# Altium schematic sheet Stylophone.SchDoc
size A4; SheetNumber: 1; SheetTotal: 1
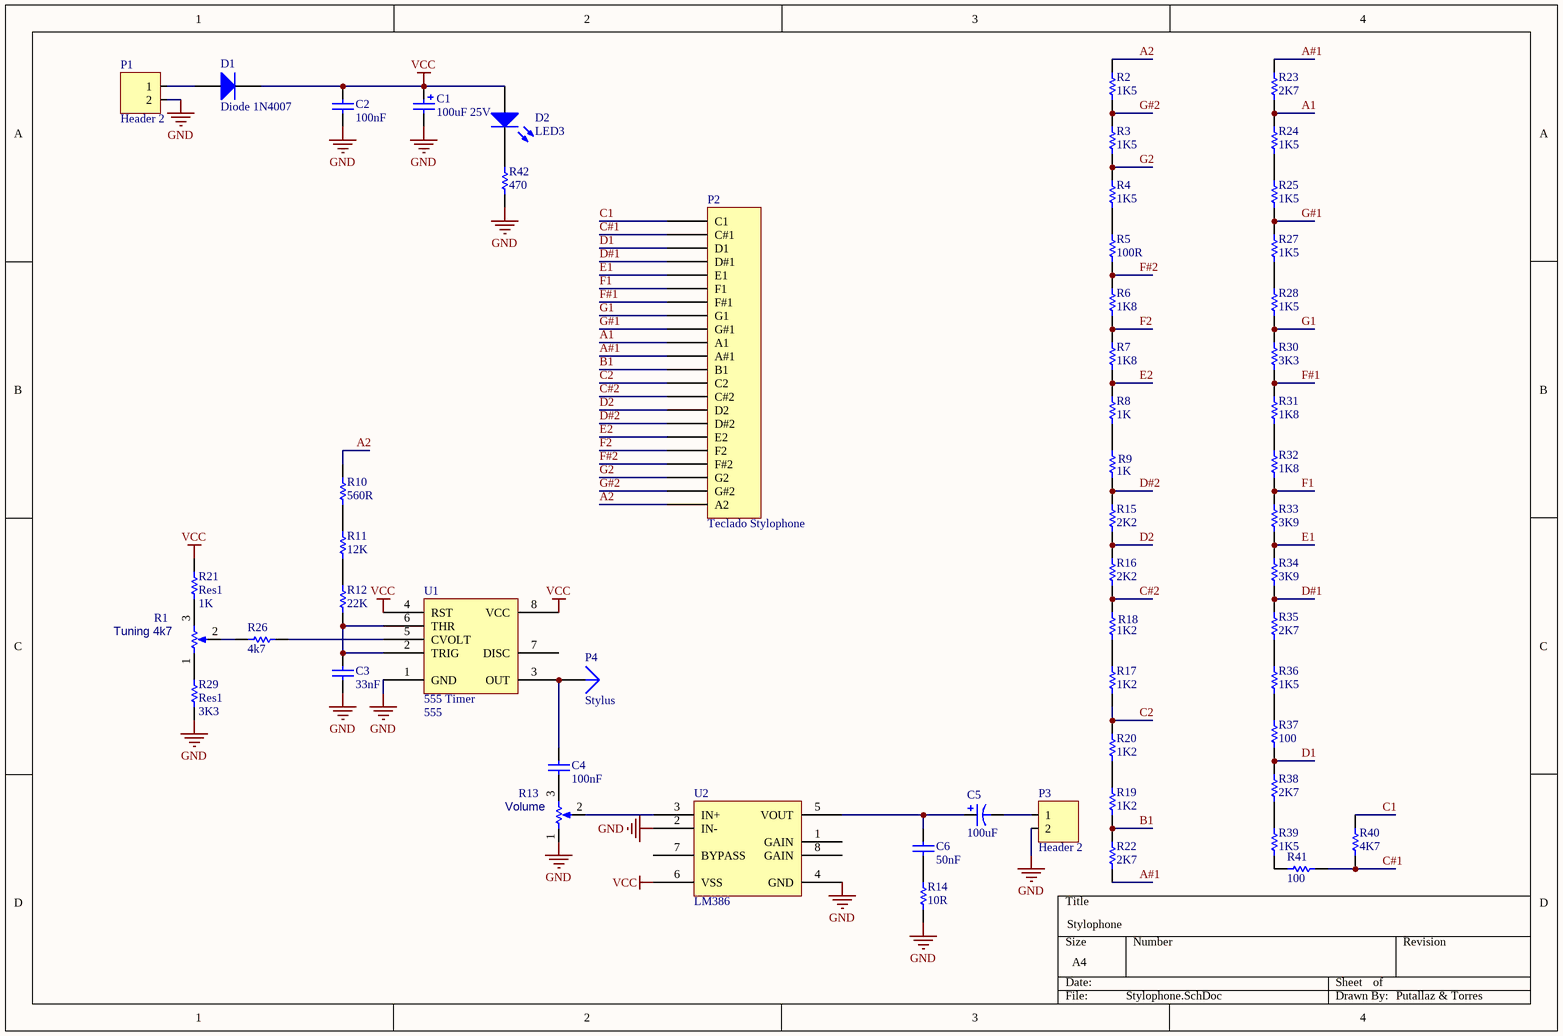
[diagram p0: Stylophone.SchDoc]

## Parts
C1  100uF 25V  [CAP SMD 100uF 25V]
C2  100nF  [0805 res-cap]
C3  33nF  [0805 res-cap]
C4  100nF  [0805 res-cap]
C5  100uF  [CAP SMD 100uF 25V]
C6  50nF  [0805 res-cap]
D1  Diode 1N4007  [DO214AC]
D2  LED3  [1206 LED]
P1  Header 2  [HDR1X2]
P2  Teclado Stylophone  [Teclado Stylophone]
P3  Header 2  [HDR1X2]
P4  Stylus  [PIN1]
R1  Tuning 4k7  [TRIMMING POTENTIOMETER]
R2  1K5  [0805 res]
R3  1K5  [0805 res]
R4  1K5  [0805 res]
R5  100R  [0805 res]
R6  1K8  [0805 res]
R7  1K8  [0805 res]
R8  1K  [0805 res]
R9  1K  [0805 res]
R10  560R  [0805 res]
R11  12K  [0805 res]
R12  22K  [0805 res]
R13  Volume  [TRIMMING POTENTIOMETER]
R14  10R  [0805 res]
R15  2K2  [0805 res]
R16  2K2  [0805 res]
R17  1K2  [0805 res]
R18  1K2  [0805 res]
R19  1K2  [0805 res]
R20  1K2  [0805 res]
R21  Res1  value 1K  [0805 res]
R22  2K7  [0805 res]
R23  2K7  [0805 res]
R24  1K5  [0805 res]
R25  1K5  [0805 res]
R26  4k7  [0805 res]
R27  1K5  [0805 res]
R28  1K5  [0805 res]
R29  Res1  value 3K3  [0805 res]
R30  3K3  [0805 res]
R31  1K8  [0805 res]
R32  1K8  [0805 res]
R33  3K9  [0805 res]
R34  3K9  [0805 res]
R35  2K7  [0805 res]
R36  1K5  [0805 res]
R37  100  [0805 res]
R38  2K7  [0805 res]
R39  1K5  [0805 res]
R40  4K7  [0805 res]
R41  100  [0805 res]
R42  470  [0805 res]
U1  555  [SOIC-8]
U2  LM386  [SOIC-8]

## Nets
GND: C1.2 C2.1 C3.1 P1.2 P3.2 R13.1(TOP) R14.1 R29.1 R42.1 U1.1(GND) U2.2(IN-) U2.4(GND)
VCC: C1.1 C2.2 D1.2(K) D2.1(A) R21.2 U1.4(RST) U1.8(VCC) U2.6(VSS)
A1: P2.A1 R23.1 R24.2
A2: P2.A2 R2.2 R10.2
A#1: P2.A#1 R22.1 R23.2
B1: P2.B1 R19.2 R22.2
C1: P2.C1 R40.2
C2: P2.C2 R17.1 R20.1
C#1: P2.C#1 R40.1 R41.1
C#2: P2.C#2 R16.1 R18.1
D1: P2.D1 R37.1 R38.2
D2: P2.D2 R15.1 R16.2
D#1: P2.D#1 R34.1 R35.2
D#2: P2.D#2 R9.1 R15.2
E1: P2.E1 R33.1 R34.2
E2: P2.E2 R7.1 R8.1
F1: P2.F1 R32.1 R33.2
F2: P2.F2 R6.1 R7.2
F#1: P2.F#1 R30.1 R31.2
F#2: P2.F#2 R5.1 R6.2
G1: P2.G1 R28.1 R30.2
G2: P2.G2 R3.1 R4.2
G#1: P2.G#1 R25.1 R27.2
G#2: P2.G#2 R2.1 R3.2
NetC3_2: C3.2 R12.1 U1.2(TRIG) U1.6(THR)
NetC4_1: C4.1 P4.1 U1.3(OUT)
NetC4_2: C4.2 R13.3(BOT)
NetC5_1: C5.1 C6.2 U2.5(VOUT)
NetC5_2: C5.2 P3.1
NetC6_1: C6.1 R14.2
NetD1_1: D1.1(A) P1.1
NetD2_2: D2.2(K) R42.2
NetR1_1: R1.1(TOP) R29.2
NetR1_2: R1.2(TAP) R26.1
NetR1_3: R1.3(BOT) R21.1
NetR4_1: R4.1 R5.2
NetR8_2: R8.2 R9.2
NetR10_1: R10.1 R11.2
NetR11_1: R11.1 R12.2
NetR13_2: R13.2(TAP) U2.3(IN+)
NetR17_2: R17.2 R18.2
NetR19_1: R19.1 R20.2
NetR24_1: R24.1 R25.2
NetR26_2: R26.2 U1.5(CVOLT)
NetR27_1: R27.1 R28.2
NetR31_1: R31.1 R32.2
NetR35_1: R35.1 R36.2
NetR36_1: R36.1 R37.2
NetR38_1: R38.1 R39.2
NetR39_1: R39.1 R41.2

Not connected (* = marked no-connect by the designer): U1 7(DISC); U2 1(GAIN) 7(BYPASS) 8(GAIN)

## Notes on the sheet
- (near R22) Stylophone
- Putallaz & Torres
- (in symbol 555) 555 Timer

## Library data of the parts
C1 = Cap Pol1: Polarized Capacitor (Radial); Value: 100pF; Published: 8-Jun-2000; LatestRevisionDate: 17-Jul-2002; LatestRevisionNote: Re-released for DXP Platform.; PackageReference: RB7.6-15; Publisher: Altium Limited; PackageDescription: Polarized Capacitor (Radial); 2 Leads
C2-C4 C6 = Cap: Capacitor; Value: 100pF; Published: 8-Jun-2000; LatestRevisionDate: 17-Jul-2002; LatestRevisionNote: Re-released for DXP Platform.; PackageReference: RAD-0.3; Publisher: Altium Limited; PackageDescription: Radial Cap, Thru-Hole; 2 Leads; 0.3 in Pin Spacing
C5 = Cap Pol D16mm: Polarized Capacitor (Axial); Value: 2200uF; Published: 8-Jun-2000; LatestRevisionDate: 17-Jul-2002; LatestRevisionNote: Re-released for DXP Platform.; PackageReference: POLAR0.8; Publisher: Altium Limited; PackageDescription: Polarized Capacitor; 2 Leads
D1 = Diode 1N4007: 1 Amp General Purpose Rectifier; Published: 8-Jun-2000; LatestRevisionDate: 17-Jul-2002; LatestRevisionNote: Re-released for DXP Platform.; DatasheetVersion: 1998; PackageVersion: Aug-1999; PackageReference: DO-41; Publisher: Altium Limited; PackageDescription: Diode, Axial; Body 5.2 x 2.7 mm (LxDia. max), Lead Dia. 0.86 mm (max); Code_JEDEC: DO-204-AL; ComponentLink1Description: Manufacturer Link; ComponentLink1URL: http://www.fairchildsemi.com/; ComponentLink2Description: Datasheet; ComponentLink2URL: http://www.fairchildsemi.com/ds/1N%2F1N4001.pdf
D2 = LED3: Typical BLUE SiC LED; Published: 8-Jun-2000; LatestRevisionDate: 17-Dec-2003; LatestRevisionNote: PCB Footprint replaced.; DatasheetVersion: 16-Apr-2002; PackageVersion: 16-Apr-2002; PackageReference: 3.5X2.8X1.9; Publisher: Altium Limited; PackageDescription: SM LED; 2 C-Bend Leads; Body 3.5 x 2.8 x 1.9 mm, inc leads (LxWxH typ)
P1 P3 = Header 2: Header, 2-Pin; LatestRevisionDate: 17-Jul-2002; LatestRevisionNote: Re-released for DXP Platform.; Publisher: Altium Limited
P4 = Plug: LatestRevisionDate: 17-Jul-2002; LatestRevisionNote: Re-released for DXP Platform.; Publisher: Altium Limited
R1 R13 = Potentiometer: 4K7; value: 1k; position: 0.5; SimulationGenericComponent: True
R2-R7 R10-R12 R14-R20 R22-R28 R30-R42 = Res1: Resistor; Value: 1K; Published: 8-Jun-2000; LatestRevisionDate: 17-Jul-2002; LatestRevisionNote: Re-released for DXP Platform.; PackageReference: AXIAL-0.3; Publisher: Altium Limited; PackageDescription: Axial Device, Thru-Hole; 2 Leads; 0.3 in Pin Spacing
R8 R9 R21 R29 = Res1: Resistor; Published: 8-Jun-2000; LatestRevisionDate: 17-Jul-2002; LatestRevisionNote: Re-released for DXP Platform.; PackageReference: AXIAL-0.3; Publisher: Altium Limited; PackageDescription: Axial Device, Thru-Hole; 2 Leads; 0.3 in Pin Spacing
  R8 R9: Value: 1K